# Altium schematic sheet КБ-002_plata_rele.SchDoc
size A1
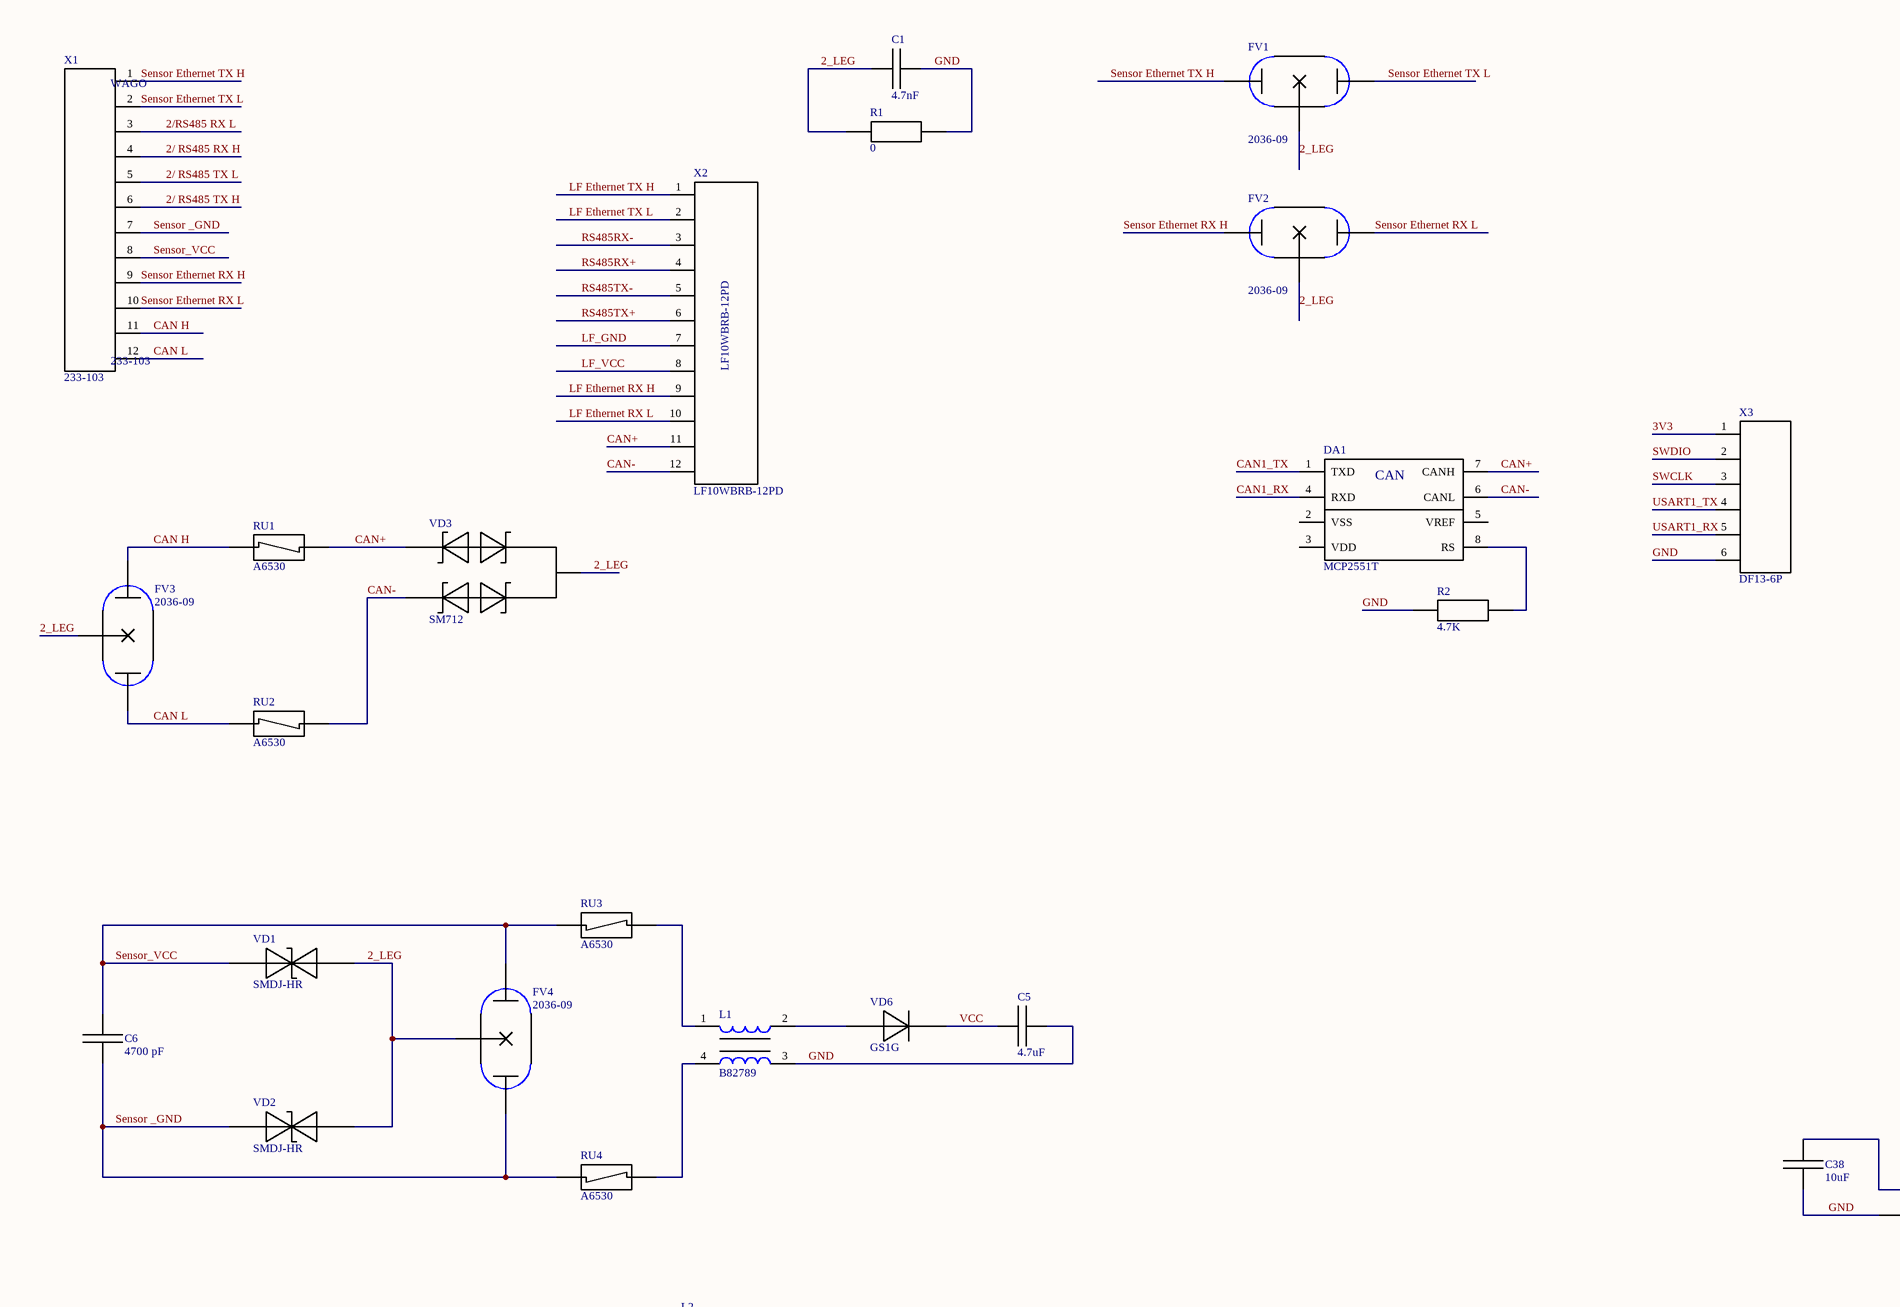
[diagram p0: КБ-002_plata_rele.SchDoc, top left]
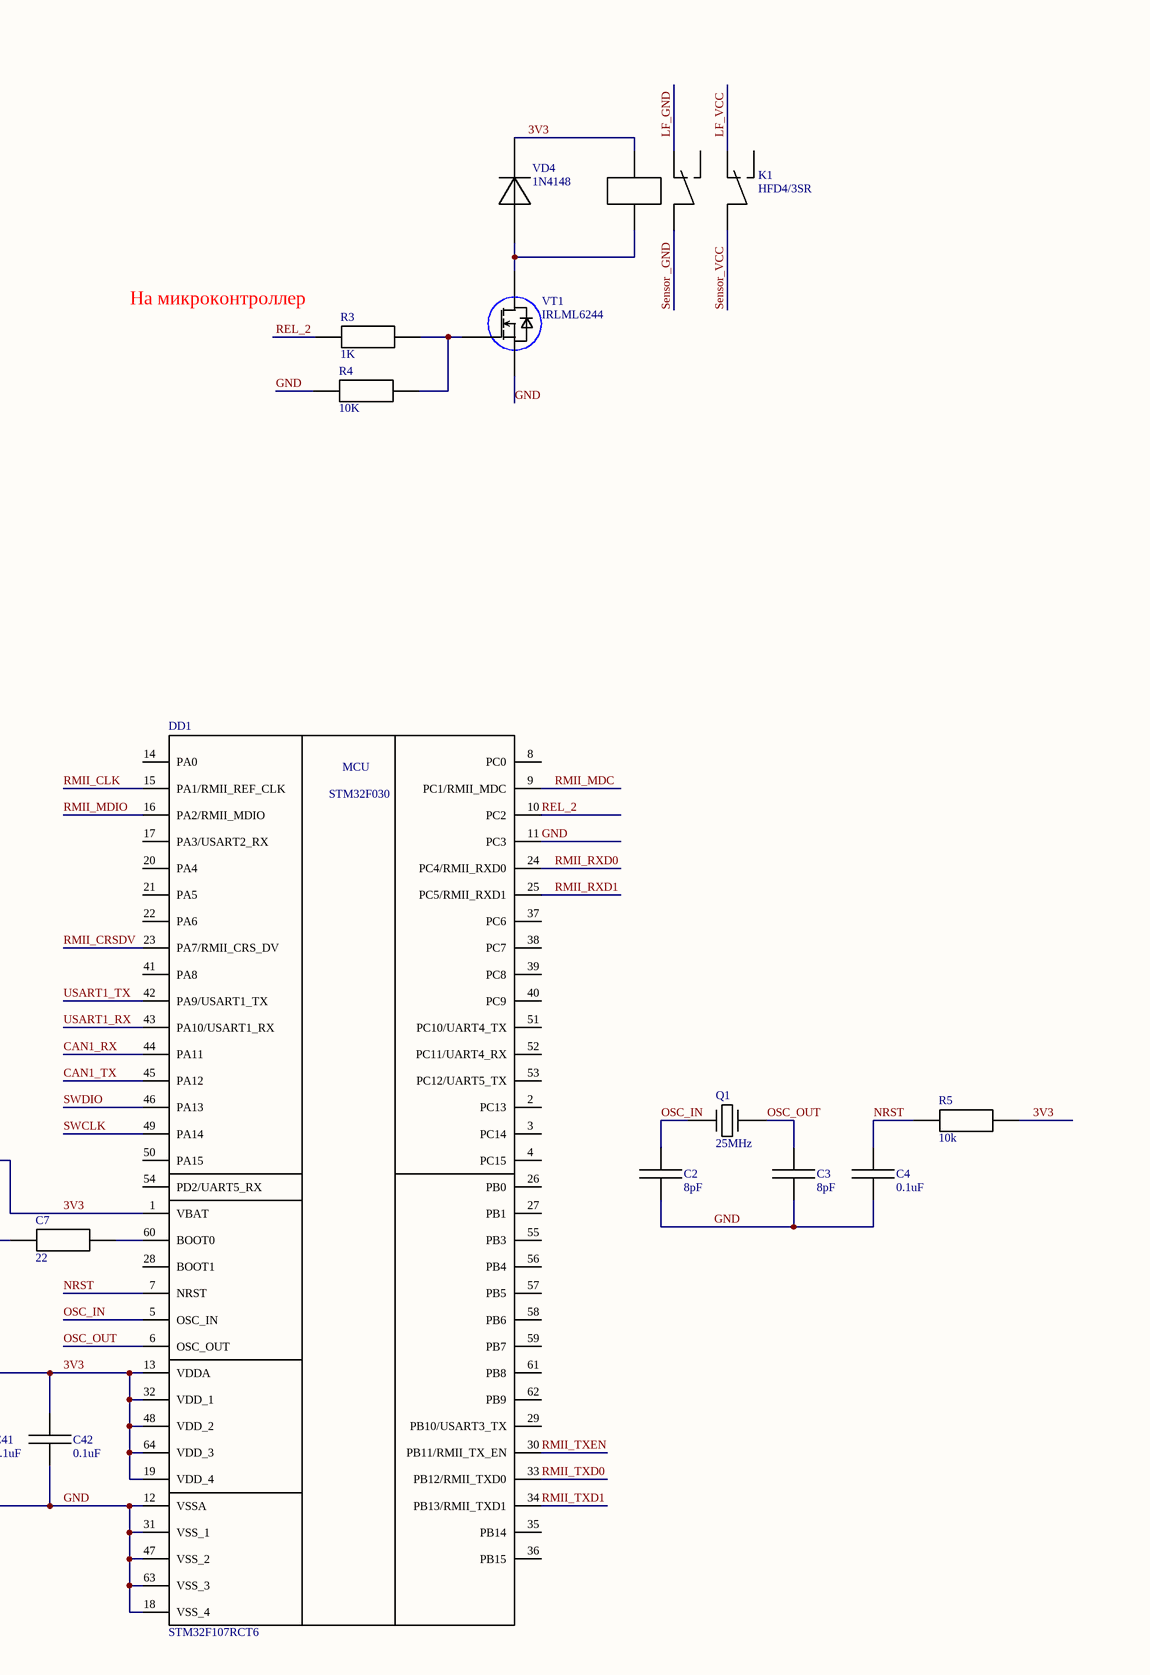
[diagram p1: КБ-002_plata_rele.SchDoc, top right]
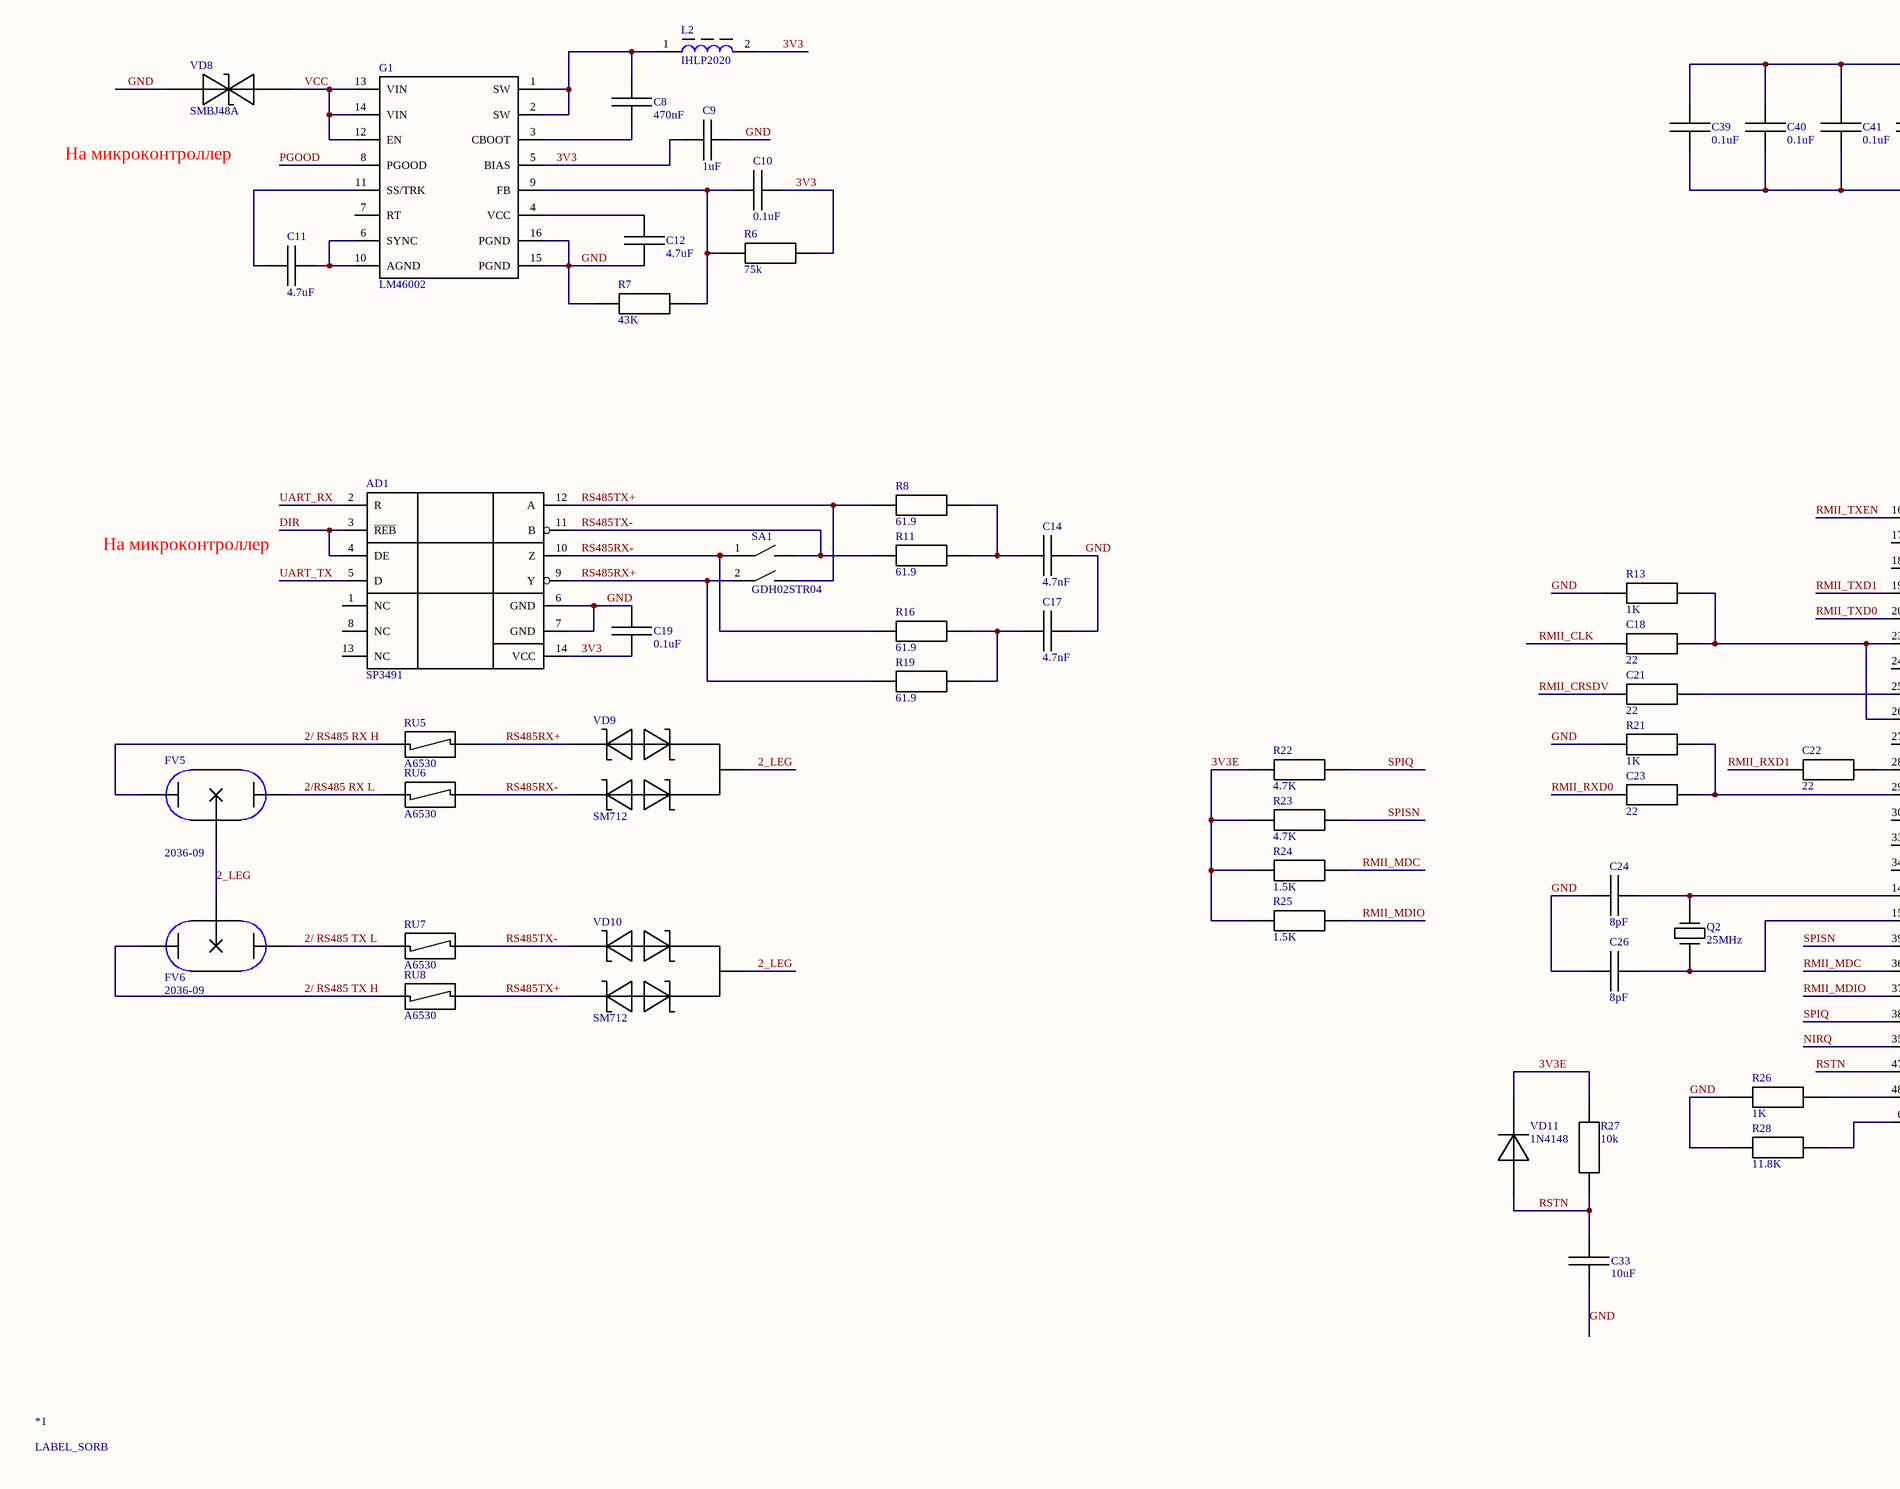
[diagram p2: КБ-002_plata_rele.SchDoc, bottom left]
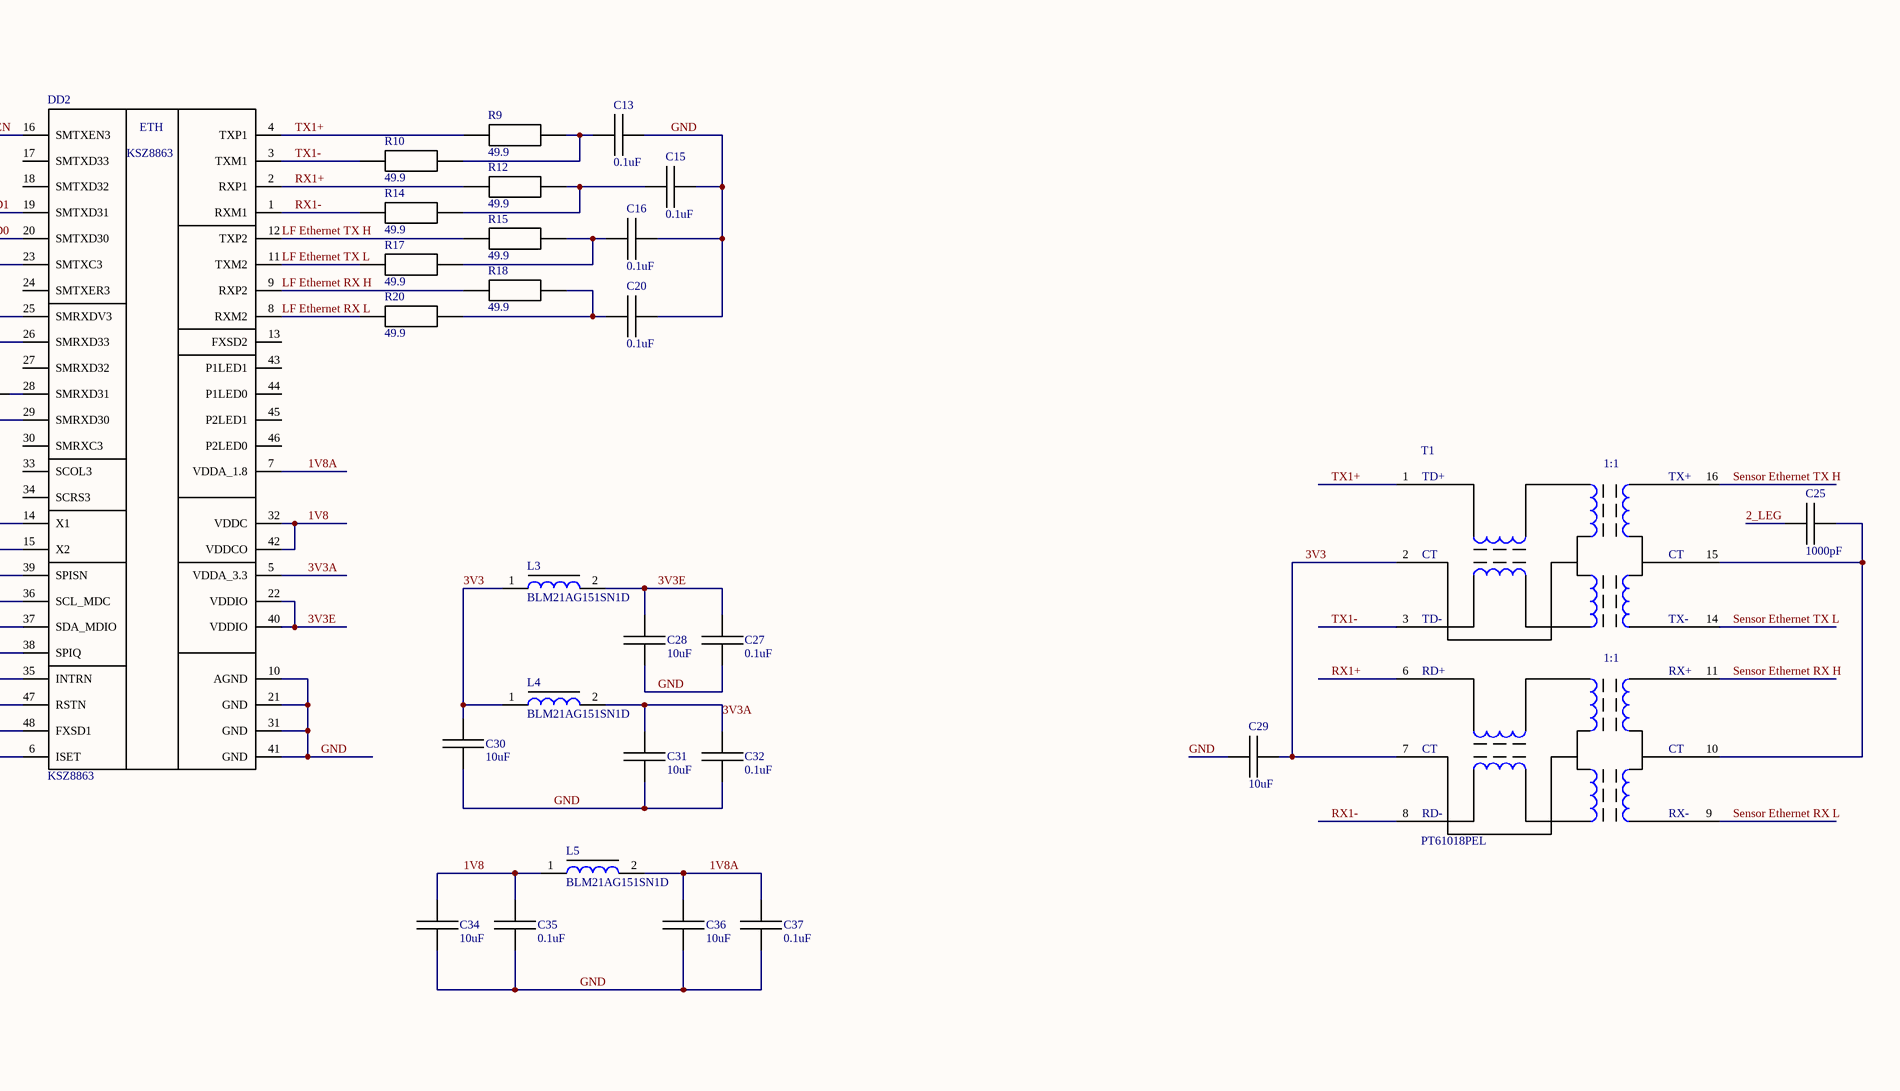
[diagram p3: КБ-002_plata_rele.SchDoc, bottom right]

## Parts
*1  LABEL_SORB  [SorbGroup]
AD1  SP3491  [SOIC-14]
C1  4.7nF  [CAP0402]
C2  8pF  [CAP0402]
C3  8pF  [CAP0402]
C4  0.1uF  [CAP0402]
C5  4.7uF  [CAP0402]
C6  4700 pF  [CAP1812]
C7  22  [RES0402]
C8  470nF  [CAP0402]
C9  1uF  [CAP0402]
C10  0.1uF  [CAP0402]
C11  4.7uF  [CAP0402]
C12  4.7uF  [CAP0402]
C13  0.1uF  [CAP0402]
C14  4.7nF  [CAP0402]
C15  0.1uF  [CAP0402]
C16  0.1uF  [CAP0402]
C17  4.7nF  [CAP0402]
C18  22  [RES0402]
C19  0.1uF  [CAP0402]
C20  0.1uF  [CAP0402]
C21  22  [RES0402]
C22  22  [RES0402]
C23  22  [RES0402]
C24  8pF  [CAP0402]
C25  1000pF  [CAP0402]
C26  8pF  [CAP0402]
C27  0.1uF  [CAP0402]
C28  10uF  [CAP0402]
C29  10uF  [CAP0402]
C30  10uF  [CAP0402]
C31  10uF  [CAP0402]
C32  0.1uF  [CAP0402]
C33  10uF  [CAP0402]
C34  10uF  [CAP0402]
C35  0.1uF  [CAP0402]
C36  10uF  [CAP0402]
C37  0.1uF  [CAP0402]
C38  10uF  [CAP0402]
C39  0.1uF  [CAP0402]
C40  0.1uF  [CAP0402]
C41  0.1uF  [CAP0402]
C42  0.1uF  [CAP0402]
DA1  MCP2551T  [SO-8]
DD1  STM32F107RCT6  [TQFP64 10x10]
DD2  KSZ8863  [TQFP48-7x7]
FV1  2036-09  [2036-09]
FV2  2036-09  [2036-09]
FV3  2036-09  [2036-09]
FV4  2036-09  [2036-09]
FV5  2036-09  [2036-09]
FV6  2036-09  [2036-09]
G1  LM46002  [HTSSOP-16]
K1  HFD4/3SR  [HFD4/3]
L1  B82789  [SIMDAD 1812]
L2  IHLP2020  [IHLP-2020CZ-51]
L3  BLM21AG151SN1D  [IND0805]
L4  BLM21AG151SN1D  [IND0805]
L5  BLM21AG151SN1D  [IND0805]
Q1  25MHz  [3225 CRYSTAL]
Q2  25MHz  [3225 CRYSTAL]
R1  0  [RES0402]
R2  4.7K  [RES0402]
R3  1K  [RES0603]
R4  10K  [RES0603]
R5  10k  [RES0402]
R6  75k  [RES0402]
R7  43K  [RES0402]
R8  61.9  [RES0402]
R9  49.9  [RES0402]
R10  49.9  [RES0402]
R11  61.9  [RES0402]
R12  49.9  [RES0402]
R13  1K  [RES0402]
R14  49.9  [RES0402]
R15  49.9  [RES0402]
R16  61.9  [RES0402]
R17  49.9  [RES0402]
R18  49.9  [RES0402]
R19  61.9  [RES0402]
R20  49.9  [RES0402]
R21  1K  [RES0402]
R22  4.7K  [RES0402]
R23  4.7K  [RES0402]
R24  1.5K  [RES0402]
R25  1.5K  [RES0402]
R26  1K  [RES0402]
R27  10k  [RES0402]
R28  11.8K  [RES0603]
RU1  A6530  [TBU-CA]
RU2  A6530  [TBU-CA]
RU3  A6530  [TBU-CA]
RU4  A6530  [TBU-CA]
RU5  A6530  [TBU-CA]
RU6  A6530  [TBU-CA]
RU7  A6530  [TBU-CA]
RU8  A6530  [TBU-CA]
SA1  GDH02STR04  [Switch DIP2]
T1  PT61018PEL  [PT61018PEL]
VD1  SMDJ-HR  [DO-214AB]
VD2  SMDJ-HR  [DO-214AB]
VD3  SM712  [SOT-23]
VD4  1N4148  [SOD-123]
VD6  GS1G  [DO-214AC]
VD8  SMBJ48A  [DO-214AA]
VD9  SM712  [SOT-23]
VD10  SM712  [SOT-23]
VD11  1N4148  [SOD-123]
VT1  IRLML6244  [SOT-23]
X1  233-103  [WAGO 233-103]
X2  LF10WBRB-12PD  [LF10WBRB-12PD]
X3  DF13-6P  [DF13-6P]

## Nets
1V8: C34.2 C35.2 DD2.32(VDDC) DD2.42(VDDCO) L5.1
1V8A: C36.2 C37.2 DD2.7(VDDA_1.8) L5.2
2/ RS485 RX H: FV5.1 RU5.1 X1.4
2/ RS485 TX H: FV6.3 RU8.1 X1.6
2/ RS485 TX L: FV6.1 RU7.1 X1.5
2/RS485 RX L: FV5.3 RU6.1 X1.3
2_LEG: C1.1 C25.1 FV1.2 FV2.2 FV3.2 FV4.2 FV5.2 FV6.2 R1.1 VD1.2 VD2.2 VD3.3 VD9.3 VD10.3
3V3: AD1.14(VCC) C9.1 C10.2 C19.1 C29.2 C30.2 C38.2 C39.2 C40.2 C41.2 C42.2 DD1.1(VBAT) DD1.13(VDDA) DD1.19(VDD_4) DD1.32(VDD_1) DD1.48(VDD_2) DD1.64(VDD_3) G1.5(BIAS) K1.1 L2.2 L3.1 L4.1 R5.2 R6.2 T1.2 T1.7 VD4.2 X3.1
3V3A: C31.2 C32.1 DD2.5(VDDA_3.3) L4.2
3V3E: C27.2 C28.2 DD2.22(VDDIO) DD2.40(VDDIO) L3.2 R22.1 R23.1 R24.1 R25.1 R27.2 VD11.2
CAN1_RX: DA1.4(RXD) DD1.44(PA11)
CAN1_TX: DA1.1(TXD) DD1.45(PA12)
CAN H: FV3.1 RU1.2 X1.11
CAN L: FV3.3 RU2.2 X1.12
CAN+: DA1.7(CANH) RU1.1 VD3.2 X2.11
CAN-: DA1.6(CANL) RU2.1 VD3.1 X2.12
DIR: AD1.3(~{REB}) AD1.4(DE)
GND: AD1.6(GND) AD1.7(GND) C1.2 C2.1 C3.1 C4.1 C5.2 C7.1 C9.2 C12.1 C13.1 C14.2 C15.1 C16.2 C17.2 C19.2 C20.2 C24.1 C26.1 C27.1 C28.1 C29.1 C30.1 C31.1 C32.2 C33.1 C34.1 C35.1 C36.1 C37.1 C38.1 C39.1 C40.1 C41.1 C42.1 DD1.11(PC3) DD1.12(VSSA) DD1.18(VSS_4) DD1.31(VSS_1) DD1.47(VSS_2) DD1.63(VSS_3) DD2.10(AGND) DD2.21(GND) DD2.31(GND) DD2.41(GND) G1.15(PGND) G1.16(PGND) L1.3 R1.2 R2.1 R4.2 R7.1 R13.1 R21.1 R26.1 R28.1 VD8.1 VT1.2 X3.6
LF Ethernet RX H: DD2.9(RXP2) R18.1 X2.9
LF Ethernet RX L: DD2.8(RXM2) R20.1 X2.10
LF Ethernet TX H: DD2.12(TXP2) R15.1 X2.1
LF Ethernet TX L: DD2.11(TXM2) R17.1 X2.2
LF_GND: K1.2 X2.7
LF_VCC: K1.7 X2.8
NIRQ: DD2.35(INTRN)
NRST: C4.2 DD1.7(NRST) R5.1
OSC_IN: C2.2 DD1.5(OSC_IN) Q1.1
OSC_OUT: C3.2 DD1.6(OSC_OUT) Q1.2
PGOOD: G1.8(PGOOD)
REL_2: DD1.10(PC2) R3.1
RMII_CLK: C18.1 DD1.15(PA1/RMII_REF_CLK)
RMII_CRSDV: C21.1 DD1.23(PA7/RMII_CRS_DV)
RMII_MDC: DD1.9(PC1/RMII_MDC) DD2.36(SCL_MDC) R24.2
RMII_MDIO: DD1.16(PA2/RMII_MDIO) DD2.37(SDA_MDIO) R25.2
RMII_RXD0: C23.1 DD1.24(PC4/RMII_RXD0)
RMII_RXD1: C22.1 DD1.25(PC5/RMII_RXD1)
RMII_TXD0: DD1.33(PB12/RMII_TXD0) DD2.20(SMTXD30)
RMII_TXD1: DD1.34(PB13/RMII_TXD1) DD2.19(SMTXD31)
RMII_TXEN: DD1.30(PB11/RMII_TX_EN) DD2.16(SMTXEN3)
RS485RX+: AD1.9(Y) R19.1 RU5.2 SA1.2 VD9.1 X2.4
RS485RX-: AD1.10(Z) R16.1 RU6.2 SA1.1 VD9.2 X2.3
RS485TX+: AD1.12(A) R8.1 RU8.2 SA1.3 VD10.2 X2.6
RS485TX-: AD1.11(B) R11.1 RU7.2 SA1.4 VD10.1 X2.5
RSTN: C33.2 DD2.47(RSTN) R27.1 VD11.1
RX1+: DD2.2(RXP1) R12.2 T1.6
RX1-: DD2.1(RXM1) R14.2 T1.8
Sensor _GND: C6.1 FV4.3 K1.3 RU4.1 VD2.1 X1.7
Sensor Ethernet RX H: FV2.1 T1.11 X1.9
Sensor Ethernet RX L: FV2.3 T1.9 X1.10
Sensor Ethernet TX H: FV1.1 T1.16 X1.1
Sensor Ethernet TX L: FV1.3 T1.14 X1.2
Sensor_VCC: C6.2 FV4.1 K1.6 RU3.1 VD1.1 X1.8
SPIQ: DD2.38(SPIQ) R22.2
SPISN: DD2.39(SPISN) R23.2
SWCLK: DD1.49(PA14) X3.3
SWDIO: DD1.46(PA13) X3.2
TX1+: DD2.4(TXP1) R9.2 T1.1
TX1-: DD2.3(TXM1) R10.2 T1.3
UART_RX: AD1.2(R)
UART_TX: AD1.5(D)
USART1_RX: DD1.43(PA10/USART1_RX) X3.5
USART1_TX: DD1.42(PA9/USART1_TX) X3.4
VCC: C5.1 G1.12(EN) G1.13(VIN) G1.14(VIN) VD6.2 VD8.2
NetC7_2: C7.2 DD1.60(BOOT0)
NetC8_1: C8.1 G1.3(CBOOT)
NetC8_2: C8.2 G1.1(SW) G1.2(SW) L2.1
NetC10_1: C10.1 G1.9(FB) R6.1 R7.2
NetC11_1: C11.1 G1.11(SS/TRK)
NetC11_2: C11.2 G1.6(SYNC) G1.10(AGND)
NetC12_2: C12.2 G1.4(VCC)
NetC13_2: C13.2 R9.1 R10.1
NetC14_1: C14.1 R8.2 R11.2
NetC15_2: C15.2 R12.1 R14.1
NetC16_1: C16.1 R15.2 R17.2
NetC17_1: C17.1 R16.2 R19.2
NetC18_2: C18.2 DD2.23(SMTXC3) DD2.26(SMRXD33) R13.2
NetC20_1: C20.1 R18.2 R20.2
NetC21_2: C21.2 DD2.25(SMRXDV3)
NetC22_2: C22.2 DD2.28(SMRXD31)
NetC23_2: C23.2 DD2.29(SMRXD30) R21.2
NetC24_2: C24.2 DD2.14(X1) Q2.2
NetC25_2: C25.2 T1.10 T1.15
NetC26_2: C26.2 DD2.15(X2) Q2.1
NetDA1_8: DA1.8(RS) R2.2
NetDD2_6: DD2.6(ISET) R28.2
NetDD2_48: DD2.48(FXSD1) R26.2
NetK1_8: K1.8 VD4.1 VT1.3
NetL1_1: L1.1 RU3.2
NetL1_2: L1.2 VD6.1
NetL1_4: L1.4 RU4.2
NetR3_2: R3.2 R4.1 VT1.1

Not connected (* = marked no-connect by the designer): AD1 1(NC) 8(NC) 13(NC); DA1 2(VSS) 3(VDD) 5(VREF); DD1 2(PC13) 3(PC14) 4(PC15) 8(PC0) 14(PA0) 17(PA3/USART2_RX) 20(PA4) 21(PA5) 22(PA6) 26(PB0) 27(PB1) 28(BOOT1) 29(PB10/USART3_TX) 35(PB14) 36(PB15) 37(PC6) 38(PC7) 39(PC8) 40(PC9) 41(PA8) 50(PA15) 51(PC10/UART4_TX) 52(PC11/UART4_RX) 53(PC12/UART5_TX) 54(PD2/UART5_RX) 55(PB3) 56(PB4) 57(PB5) 58(PB6) 59(PB7) 61(PB8) 62(PB9); DD2 13(FXSD2) 17(SMTXD33) 18(SMTXD32) 24(SMTXER3) 27(SMRXD32) 30(SMRXC3) 33(SCOL3) 34(SCRS3) 43(P1LED1) 44(P1LED0) 45(P2LED1) 46(P2LED0); G1 7(RT); K1 4 5

## Notes on the sheet
- (near R3) На микроконтроллер
- На микроконтроллер
- Title
- Size:
- Date:
- File:
- A1
- Number:
- Time:
- Revision:
- Sheet
- of
- (in symbol KSZ8863) ETH
- (in symbol MCPT2551T) CAN
- (in symbol PT61018PEL) 1:1; TD+; TX+; CT; TD-; TX-; RD+; RX+; RD-; RX-
- (in symbol STM32F107) MCU; STM32F030
- (in symbol WAGO 233-103) WAGO

## Library data of the parts
AD1 = SP3491: SP3491CN-L, Приемопередатчик RS485, 3В-3.465В, NSOIC-14
C1 C14 C17 = CAP0402 4.7nF: Кер.чип.конд. 0402 X5R 4.7нФ 16В 10%, GRM155R61C472KA01D
C2 C3 C24 C26 = CAP0402 8pF: Кер.чип.конд. 0402 C0G 8пФ 50В, GRM1555C1H8R0CA01D
C4 C10 C13 C15 C16 C19 C20 C27 C32 C35 C37 C39-C42 = CAP0402 0.1uF: Кер.ЧИП конд. 0.1мкФ X7R 10%, 0402, 16В, GRM155R71C104K
C5 C11 C12 = CAP0402 4,7uF: Кер.чип.конд. 0402 X5R 4.7мкФ 4В 20%, GRM155R60G475ME87D
C6 = CAP1812 4700pF: 4700пф X7R 2000в 10% (1812) Чип керам,конденсатор MA1812XR472K202ERG (FV43X472K202EFG
C7 C18 C21-C23 = RES0402 22: 0.062Вт 0402 22 Ом, 1%, Чип резистор (SMD)
C8 = CAP0402 470nF: Кер.чип.конд. 0402 X5R 470нФ 10В 10% , GRM155R61A474KE15D
C9 = CAP0402 1uF: Кер.ЧИП конд. 1мкФ X5R 10%, 0402, 10В, GRM155R61A105K
C25 = CAP0402 1000pF: Кер.ЧИП конд. 1000пФ NP0 5%, 0402, 50В, GRM1555C1H102J
C28-C31 C33 C34 C36 C38 = CAP0402 10uF: Кер.чип.конд. 0402 X5R 10мкФ 2.5В 20%, GRM155R60E106ME16D
DA1 = MCPT2551T: MCP2551T-I/SN, CAN приемопередатчик, быстрый [SO-8]
DD1 = STM32F107: STM32F107RCT6, Микроконтроллер 32-Бит, Cortex-M3, 72МГц, 256КБ Flash [LQFP-64]
DD2 = KSZ8863: KSZ8863RLLI-TR, Ethernet контроллер, 100 Мбит/с, IEEE 802.3, IEEE 802.3u, 3.135 В, 3.465 В, LQFP, 48 вывод(-ов)
FV1-FV6 = 2036-09: 2036-09-SM-RPLF Газоразрядная трубка
G1 = LM46002: LM46002PWPT, Импульсный понижающий DC-DC стабилизатор, регулируемый, 3.5В-60В (Vin), 1В-28В, 2А, HTSSOP-16
K1 = HFD4/3SR: HFD4/3SR (IM01GR), Реле 3VDC 2пер. 2A/250VAC
L1 = B82789: B82789C0104N002
L2 = IHLP2020CZER100M11
Q1 Q2 = 25MHz: NX3225SA-25MHZ, 25 МГц, 15/25ppm, 8пФ, -40...+85°C, SMD 3.2*2.5*0.55мм, Кварцевый резонатор
R1 = RES0402 0: 0.062Вт 0402 0 Ом 5%, Чип резистор (SMD)
R2 R22 R23 = RES0402 4.7K: 0.062Вт 0402 4.7 кОм, 5%, Чип резистор (SMD)
R3 = RES0603 1K: 0.063Вт 0603 1 кОм, 1%, Чип резистор (SMD)
R4 = RES0603 10K: 0.063Вт 0603 10 кОм, 1%, Чип резистор (SMD)
R5 R27 = RES0402 10k: 0.062Вт 0402 10 кОм, 1%, Чип резистор (SMD)
R6 = RES0402 75k: 0.062Вт 0402 75 кОм, 1%, Чип резистор (SMD)
R7 = RES0402 43K: 0.062Вт 0402 43 кОм, 1%, Чип резистор (SMD)
R8 R11 R16 R19 = RES0402 61.9: 0.062Вт 0402 62 Ом, 1%, Чип резистор (SMD)
R9 R10 R12 R14 R15 R17 R18 R20 = RES0402 49.9: 49,9 Ом 1% 0402 FCF02FV-49R9 чип-резистор PDC
R13 R21 R26 = RES0402 1K: 0.062Вт 0402 1 кОм, 1%, Чип резистор (SMD)
R24 R25 = RES0402 1.5K: 0.062Вт 0402 1.5 кОм, 1%, Чип резистор (SMD)
R28 = RES0603 11.8K: 11,8 кОм 0603 1% RI0603L1182FT чип резистор Hottech
RU1-RU8 = TBU-CA: TBU-CA065-300-WH, Защитная ИС
SA1 = GDH02STR04: GDH02STR04, Switch DIP OFF ON SPST 2 Recessed Rocker 0.025A 24VDC Gull Wing 1.27mm SMD T/R
VD1 VD2 = SMDJ: 5.0SMDJ45A, TVS Diode Single Uni-Dir 45V 5KW 2-Pin SMC T/R
VD3 VD9 VD10 = SM712: SM712.TCT, Диод защитный для устройсв стандарта RS-485, 400Вт, 12В, [SOT-23]
VD4 VD11 = 1N4148: 1N4148W, Диод 150мА 100В [SOD-123]
VD6 = GS1G: GS1G, Диод 1А 400В [DO-214AC / SMA]
VD8 = SMBJ48A: SMBJ48A-TR, Защитный диод, 600Вт, 48В, [SMB / DO-214AA]
VT1 = IRLML6244: IRLML6244TRPBF, Транзистор, N-канал 20В 6.3А [Micro3 / SOT-23]
X1 = WAGO 233-103: WAGO 233-103  Клемма на печатную плату; 0,5 мм²; Шаг контактов 2,5 мм; 3-пол.; CAGE  CLAMP®; 0,50 mm²; серые
X2 = LF10WBRB-12PD: LF10WBRB-12S, LF Series Miniature Panel Mount Connector, 12 contacts Socket
X3 = DF13-6P: DF13-6P-1.25DSA